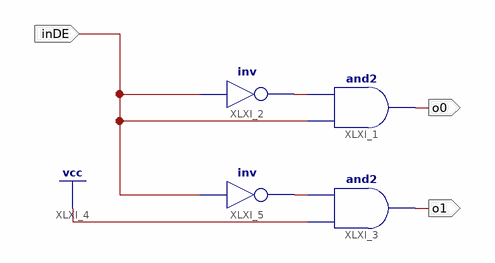
[diagram p0: schematic sheet 1]
// Xilinx ISE schematic decoder1_2.sch (spartan6) as structural Verilog: 4 symbols, 3 ports
module decoder1_2 (
  input  inDE,
  output o0,
  output o1
);

  wire XLXN_1, XLXN_10;

  and XLXI_1 (o0, inDE, XLXN_1);
  not XLXI_2 (XLXN_1, inDE);
  and XLXI_3 (o1, 1'b1, XLXN_10);
  not XLXI_5 (XLXN_10, inDE);
endmodule
